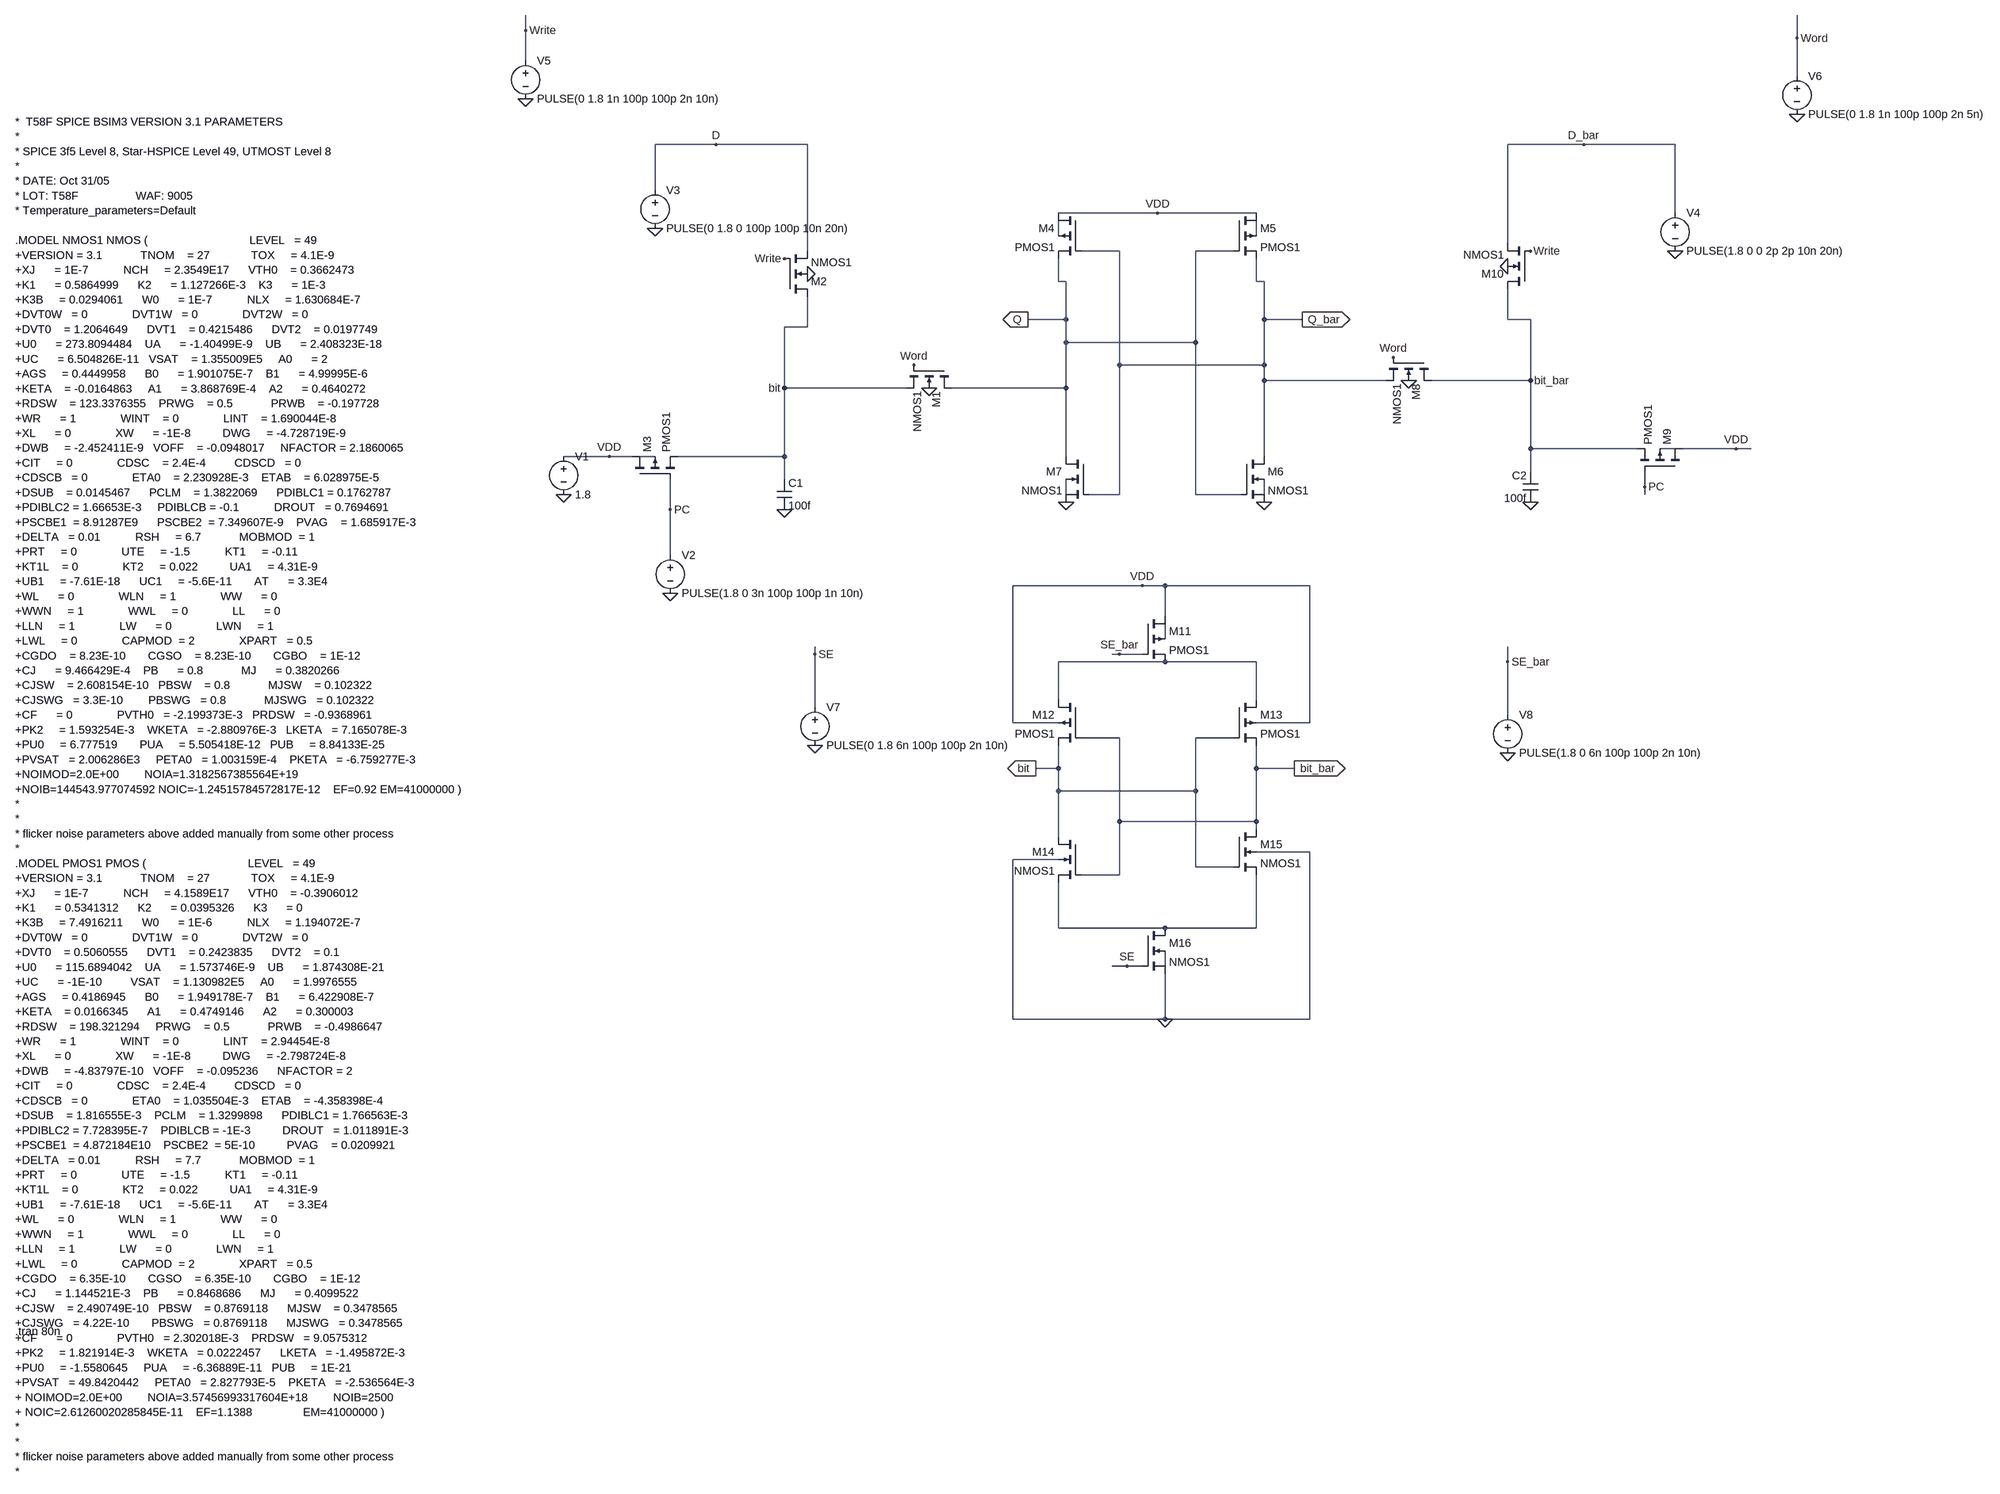
[diagram p0: schematic SRAM_final.asc]
SRAM_final.asc, the LTspice schematic file:
Version 4
SHEET 1 4148 2576
WIRE 1056 -176 1056 -208
WIRE 3728 -160 3728 -208
WIRE 1056 -112 1056 -176
WIRE 3728 -80 3728 -160
WIRE 1456 64 1328 64
WIRE 1648 64 1456 64
WIRE 3280 64 3120 64
WIRE 3472 64 3280 64
WIRE 1328 160 1328 64
WIRE 2384 208 2176 208
WIRE 2592 208 2384 208
WIRE 3472 208 3472 64
WIRE 2176 256 2176 224
WIRE 2592 256 2592 224
WIRE 3120 272 3120 64
WIRE 1648 288 1648 64
WIRE 2304 288 2224 288
WIRE 2544 288 2464 288
WIRE 2176 352 2176 304
WIRE 2192 352 2176 352
WIRE 2592 352 2592 304
WIRE 2608 352 2592 352
WIRE 2192 432 2192 352
WIRE 2192 432 2112 432
WIRE 2608 432 2608 352
WIRE 2688 432 2608 432
WIRE 3120 432 3120 368
WIRE 3168 432 3120 432
WIRE 1648 448 1648 384
WIRE 1648 448 1600 448
WIRE 2192 480 2192 432
WIRE 2464 480 2464 288
WIRE 2464 480 2192 480
WIRE 2304 528 2304 288
WIRE 2608 528 2608 432
WIRE 2608 528 2304 528
WIRE 2608 560 2608 528
WIRE 2864 560 2608 560
WIRE 3168 560 3168 432
WIRE 3168 560 2960 560
WIRE 1600 576 1600 448
WIRE 1856 576 1600 576
WIRE 2192 576 2192 480
WIRE 2192 576 1952 576
WIRE 3168 704 3168 560
WIRE 3392 704 3168 704
WIRE 3472 704 3440 704
WIRE 3600 704 3488 704
WIRE 3632 704 3600 704
WIRE 1232 720 1136 720
WIRE 1280 720 1232 720
WIRE 1328 720 1296 720
WIRE 1600 720 1600 576
WIRE 1600 720 1376 720
WIRE 2192 720 2192 576
WIRE 2608 720 2608 560
WIRE 3168 752 3168 704
WIRE 1600 768 1600 720
WIRE 3408 784 3408 752
WIRE 2192 800 2192 768
WIRE 2304 800 2304 528
WIRE 2304 800 2240 800
WIRE 2464 800 2464 480
WIRE 2560 800 2464 800
WIRE 2608 800 2608 768
WIRE 3408 800 3408 784
WIRE 1360 832 1360 768
WIRE 1360 928 1360 832
WIRE 2352 992 2080 992
WIRE 2400 992 2352 992
WIRE 2704 992 2400 992
WIRE 2400 1056 2400 992
WIRE 2400 1104 2400 1072
WIRE 1664 1136 1664 1120
WIRE 2304 1136 2288 1136
WIRE 2352 1136 2304 1136
WIRE 2400 1152 2176 1152
WIRE 2592 1152 2400 1152
WIRE 3120 1152 3120 1120
WIRE 2176 1232 2176 1152
WIRE 2592 1232 2592 1152
WIRE 1664 1248 1664 1136
WIRE 3120 1264 3120 1152
WIRE 2080 1280 2080 992
WIRE 2176 1280 2080 1280
WIRE 2704 1280 2704 992
WIRE 2704 1280 2592 1280
WIRE 2304 1312 2224 1312
WIRE 2544 1312 2464 1312
WIRE 2176 1376 2176 1328
WIRE 2176 1376 2128 1376
WIRE 2592 1376 2592 1328
WIRE 2672 1376 2592 1376
WIRE 2176 1424 2176 1376
WIRE 2464 1424 2464 1312
WIRE 2464 1424 2176 1424
WIRE 2304 1488 2304 1312
WIRE 2592 1488 2592 1376
WIRE 2592 1488 2304 1488
WIRE 2592 1504 2592 1488
WIRE 2176 1520 2176 1424
WIRE 2704 1552 2592 1552
WIRE 2176 1568 2080 1568
WIRE 2464 1584 2464 1424
WIRE 2544 1584 2464 1584
WIRE 2304 1600 2304 1488
WIRE 2304 1600 2224 1600
WIRE 2176 1712 2176 1616
WIRE 2400 1712 2176 1712
WIRE 2592 1712 2592 1600
WIRE 2592 1712 2400 1712
WIRE 2320 1792 2288 1792
WIRE 2352 1792 2320 1792
WIRE 2400 1792 2400 1760
WIRE 2080 1904 2080 1568
WIRE 2400 1904 2400 1808
WIRE 2400 1904 2080 1904
WIRE 2704 1904 2704 1552
WIRE 2704 1904 2400 1904
FLAG 1872 528 Word
FLAG 1600 576 bit
FLAG 1904 576 0
FLAG 2384 208 VDD
FLAG 2112 432 Q
IOPIN 2112 432 Out
FLAG 2688 432 Q_bar
IOPIN 2688 432 Out
FLAG 2880 512 Word
FLAG 2912 560 0
FLAG 3168 560 bit_bar
FLAG 1600 304 Write
FLAG 3168 288 Write
FLAG 1136 800 0
FLAG 1648 336 0
FLAG 3120 320 0
FLAG 1360 1008 0
FLAG 1232 720 VDD
FLAG 1360 832 PC
FLAG 1328 240 0
FLAG 1600 832 0
FLAG 2192 816 0
FLAG 2608 816 0
FLAG 3168 816 0
FLAG 1456 64 D
FLAG 3600 704 VDD
FLAG 3408 784 PC
FLAG 3472 288 0
FLAG 1056 -32 0
FLAG 3728 0 0
FLAG 1056 -176 Write
FLAG 3728 -160 Word
FLAG 3280 64 D_bar
FLAG 2304 1136 SE_bar
FLAG 2320 1792 SE
FLAG 2352 992 VDD
FLAG 2400 1904 0
FLAG 2128 1376 bit
IOPIN 2128 1376 Out
FLAG 2672 1376 bit_bar
IOPIN 2672 1376 Out
FLAG 1664 1328 0
FLAG 3120 1344 0
FLAG 1664 1136 SE
FLAG 3120 1152 SE_bar
SYMBOL nmos4 1952 528 R90
SYMATTR InstName M1
SYMATTR Value NMOS1
SYMATTR Value2 l=180n w=600n
SYMBOL cap 1584 768 R0
SYMATTR InstName C1
SYMATTR Value 100f
SYMBOL pmos4 1280 768 R270
SYMATTR InstName M3
SYMATTR Value PMOS1
SYMATTR Value2 l=180n w=400n
SYMBOL pmos4 2224 208 M0
SYMATTR InstName M4
SYMATTR Value PMOS1
SYMATTR Value2 l=180n w=400n
SYMBOL pmos4 2544 208 R0
SYMATTR InstName M5
SYMATTR Value PMOS1
SYMATTR Value2 l=180n w=400n
SYMBOL nmos4 2560 720 R0
SYMATTR InstName M6
SYMATTR Value NMOS1
SYMATTR Value2 l=180n w=800n
SYMBOL nmos4 2240 720 M0
SYMATTR InstName M7
SYMATTR Value NMOS1
SYMATTR Value2 l=180n w=800n
SYMBOL nmos4 1600 384 M180
SYMATTR InstName M2
SYMATTR Value NMOS1
SYMATTR Value2 l=180n w=400n
SYMBOL nmos4 2960 512 R90
SYMATTR InstName M8
SYMATTR Value NMOS1
SYMATTR Value2 l=180n w=600n
SYMBOL cap 3184 752 M0
SYMATTR InstName C2
SYMATTR Value 100f
SYMBOL pmos4 3488 752 M270
SYMATTR InstName M9
SYMATTR Value PMOS1
SYMATTR Value2 l=180n w=400n
SYMBOL nmos4 3168 368 R180
SYMATTR InstName M10
SYMATTR Value NMOS1
SYMATTR Value2 l=180n w=400n
SYMBOL voltage 1136 704 R0
SYMATTR InstName V1
SYMATTR Value 1.8
SYMBOL voltage 1360 912 R0
SYMATTR InstName V2
SYMATTR Value PULSE(1.8 0 3n 100p 100p 1n 10n)
SYMBOL voltage 1328 144 R0
SYMATTR InstName V3
SYMATTR Value PULSE(0 1.8 0 100p 100p 10n 20n)
SYMBOL voltage 3472 192 R0
SYMATTR InstName V4
SYMATTR Value PULSE(1.8 0 0 2p 2p 10n 20n)
SYMBOL voltage 1056 -128 R0
SYMATTR InstName V5
SYMATTR Value PULSE(0 1.8 1n 100p 100p 2n 10n)
SYMBOL voltage 3728 -96 R0
SYMATTR InstName V6
SYMATTR Value PULSE(0 1.8 1n 100p 100p 2n 5n)
SYMBOL pmos4 2352 1056 R0
SYMATTR InstName M11
SYMATTR Value PMOS1
SYMATTR Value2 l=180n w=600n
SYMBOL pmos4 2224 1232 M0
SYMATTR InstName M12
SYMATTR Value PMOS1
SYMATTR Value2 l=180n w=400n
SYMBOL pmos4 2544 1232 R0
SYMATTR InstName M13
SYMATTR Value PMOS1
SYMATTR Value2 l=180n w=400n
SYMBOL nmos4 2224 1520 M0
SYMATTR InstName M14
SYMATTR Value NMOS1
SYMATTR Value2 l=180n w=800n
SYMBOL nmos4 2544 1504 R0
SYMATTR InstName M15
SYMATTR Value NMOS1
SYMATTR Value2 l=180n w=800n
SYMBOL nmos4 2352 1712 R0
SYMATTR InstName M16
SYMATTR Value NMOS1
SYMATTR Value2 l=180n w=600n
SYMBOL voltage 1664 1232 R0
SYMATTR InstName V7
SYMATTR Value PULSE(0 1.8 6n 100p 100p 2n 10n)
SYMBOL voltage 3120 1248 R0
SYMATTR InstName V8
SYMATTR Value PULSE(1.8 0 6n 100p 100p 2n 10n)
TEXT -240 16 Left 2 !*  T58F SPICE BSIM3 VERSION 3.1 PARAMETERS\n* \n* SPICE 3f5 Level 8, Star-HSPICE Level 49, UTMOST Level 8\n* \n* DATE: Oct 31/05\n* LOT: T58F                  WAF: 9005\n* Temperature_parameters=Default\n\n.MODEL NMOS1 NMOS (                                LEVEL   = 49\n+VERSION = 3.1            TNOM    = 27             TOX     = 4.1E-9\n+XJ      = 1E-7           NCH     = 2.3549E17      VTH0    = 0.3662473\n+K1      = 0.5864999      K2      = 1.127266E-3    K3      = 1E-3\n+K3B     = 0.0294061      W0      = 1E-7           NLX     = 1.630684E-7\n+DVT0W   = 0              DVT1W   = 0              DVT2W   = 0\n+DVT0    = 1.2064649      DVT1    = 0.4215486      DVT2    = 0.0197749\n+U0      = 273.8094484    UA      = -1.40499E-9    UB      = 2.408323E-18\n+UC      = 6.504826E-11   VSAT    = 1.355009E5     A0      = 2\n+AGS     = 0.4449958      B0      = 1.901075E-7    B1      = 4.99995E-6\n+KETA    = -0.0164863     A1      = 3.868769E-4    A2      = 0.4640272\n+RDSW    = 123.3376355    PRWG    = 0.5            PRWB    = -0.197728\n+WR      = 1              WINT    = 0              LINT    = 1.690044E-8\n+XL      = 0              XW      = -1E-8          DWG     = -4.728719E-9\n+DWB     = -2.452411E-9   VOFF    = -0.0948017     NFACTOR = 2.1860065\n+CIT     = 0              CDSC    = 2.4E-4         CDSCD   = 0\n+CDSCB   = 0              ETA0    = 2.230928E-3    ETAB    = 6.028975E-5\n+DSUB    = 0.0145467      PCLM    = 1.3822069      PDIBLC1 = 0.1762787\n+PDIBLC2 = 1.66653E-3     PDIBLCB = -0.1           DROUT   = 0.7694691\n+PSCBE1  = 8.91287E9      PSCBE2  = 7.349607E-9    PVAG    = 1.685917E-3\n+DELTA   = 0.01           RSH     = 6.7            MOBMOD  = 1\n+PRT     = 0              UTE     = -1.5           KT1     = -0.11\n+KT1L    = 0              KT2     = 0.022          UA1     = 4.31E-9\n+UB1     = -7.61E-18      UC1     = -5.6E-11       AT      = 3.3E4\n+WL      = 0              WLN     = 1              WW      = 0\n+WWN     = 1              WWL     = 0              LL      = 0\n+LLN     = 1              LW      = 0              LWN     = 1\n+LWL     = 0              CAPMOD  = 2              XPART   = 0.5\n+CGDO    = 8.23E-10       CGSO    = 8.23E-10       CGBO    = 1E-12\n+CJ      = 9.466429E-4    PB      = 0.8            MJ      = 0.3820266\n+CJSW    = 2.608154E-10   PBSW    = 0.8            MJSW    = 0.102322\n+CJSWG   = 3.3E-10        PBSWG   = 0.8            MJSWG   = 0.102322\n+CF      = 0              PVTH0   = -2.199373E-3   PRDSW   = -0.9368961\n+PK2     = 1.593254E-3    WKETA   = -2.880976E-3   LKETA   = 7.165078E-3\n+PU0     = 6.777519       PUA     = 5.505418E-12   PUB     = 8.84133E-25\n+PVSAT   = 2.006286E3     PETA0   = 1.003159E-4    PKETA   = -6.759277E-3\n+NOIMOD=2.0E+00		NOIA=1.3182567385564E+19\n+NOIB=144543.977074592 NOIC=-1.24515784572817E-12	EF=0.92 EM=41000000 )\n*\n*\n* flicker noise parameters above added manually from some other process\n* \n.MODEL PMOS1 PMOS (                                LEVEL   = 49\n+VERSION = 3.1            TNOM    = 27             TOX     = 4.1E-9\n+XJ      = 1E-7           NCH     = 4.1589E17      VTH0    = -0.3906012\n+K1      = 0.5341312      K2      = 0.0395326      K3      = 0\n+K3B     = 7.4916211      W0      = 1E-6           NLX     = 1.194072E-7\n+DVT0W   = 0              DVT1W   = 0              DVT2W   = 0\n+DVT0    = 0.5060555      DVT1    = 0.2423835      DVT2    = 0.1\n+U0      = 115.6894042    UA      = 1.573746E-9    UB      = 1.874308E-21\n+UC      = -1E-10         VSAT    = 1.130982E5     A0      = 1.9976555\n+AGS     = 0.4186945      B0      = 1.949178E-7    B1      = 6.422908E-7\n+KETA    = 0.0166345      A1      = 0.4749146      A2      = 0.300003\n+RDSW    = 198.321294     PRWG    = 0.5            PRWB    = -0.4986647\n+WR      = 1              WINT    = 0              LINT    = 2.94454E-8\n+XL      = 0              XW      = -1E-8          DWG     = -2.798724E-8\n+DWB     = -4.83797E-10   VOFF    = -0.095236      NFACTOR = 2\n+CIT     = 0              CDSC    = 2.4E-4         CDSCD   = 0\n+CDSCB   = 0              ETA0    = 1.035504E-3    ETAB    = -4.358398E-4\n+DSUB    = 1.816555E-3    PCLM    = 1.3299898      PDIBLC1 = 1.766563E-3\n+PDIBLC2 = 7.728395E-7    PDIBLCB = -1E-3          DROUT   = 1.011891E-3\n+PSCBE1  = 4.872184E10    PSCBE2  = 5E-10          PVAG    = 0.0209921\n+DELTA   = 0.01           RSH     = 7.7            MOBMOD  = 1\n+PRT     = 0              UTE     = -1.5           KT1     = -0.11\n+KT1L    = 0              KT2     = 0.022          UA1     = 4.31E-9\n+UB1     = -7.61E-18      UC1     = -5.6E-11       AT      = 3.3E4\n+WL      = 0              WLN     = 1              WW      = 0\n+WWN     = 1              WWL     = 0              LL      = 0\n+LLN     = 1              LW      = 0              LWN     = 1\n+LWL     = 0              CAPMOD  = 2              XPART   = 0.5\n+CGDO    = 6.35E-10       CGSO    = 6.35E-10       CGBO    = 1E-12\n+CJ      = 1.144521E-3    PB      = 0.8468686      MJ      = 0.4099522\n+CJSW    = 2.490749E-10   PBSW    = 0.8769118      MJSW    = 0.3478565\n+CJSWG   = 4.22E-10       PBSWG   = 0.8769118      MJSWG   = 0.3478565\n+CF      = 0              PVTH0   = 2.302018E-3    PRDSW   = 9.0575312\n+PK2     = 1.821914E-3    WKETA   = 0.0222457      LKETA   = -1.495872E-3\n+PU0     = -1.5580645     PUA     = -6.36889E-11   PUB     = 1E-21\n+PVSAT   = 49.8420442     PETA0   = 2.827793E-5    PKETA   = -2.536564E-3 \n+ NOIMOD=2.0E+00		NOIA=3.57456993317604E+18		NOIB=2500\n+ NOIC=2.61260020285845E-11	EF=1.1388				EM=41000000 )\n*\n*\n* flicker noise parameters above added manually from some other process\n*
TEXT -240 2560 Left 2 !.tran 80n

The netlist it stands for:
* SRAM_final.asc
M1 Q Word bit 0 NMOS1 l=180n w=600n
C1 bit 0 100f
M3 VDD PC bit N004 PMOS1 l=180n w=400n
M4 VDD Q_bar Q N001 PMOS1 l=180n w=400n
M5 VDD Q Q_bar N002 PMOS1 l=180n w=400n
M6 Q_bar Q 0 N006 NMOS1 l=180n w=800n
M7 Q Q_bar 0 N005 NMOS1 l=180n w=800n
M2 bit Write D 0 NMOS1 l=180n w=400n
M8 bit_bar Word Q_bar 0 NMOS1 l=180n w=600n
C2 bit_bar 0 100f
M9 VDD PC bit_bar N003 PMOS1 l=180n w=400n
M10 bit_bar Write D_bar 0 NMOS1 l=180n w=400n
V1 VDD 0 1.8
V2 PC 0 PULSE(1.8 0 3n 100p 100p 1n 10n)
V3 D 0 PULSE(0 1.8 0 100p 100p 10n 20n)
V4 D_bar 0 PULSE(1.8 0 0 2p 2p 10n 20n)
V5 Write 0 PULSE(0 1.8 1n 100p 100p 2n 10n)
V6 Word 0 PULSE(0 1.8 1n 100p 100p 2n 5n)
M11 VDD SE_bar N008 N007 PMOS1 l=180n w=600n
M12 N008 bit_bar bit VDD PMOS1 l=180n w=400n
M13 N008 bit bit_bar VDD PMOS1 l=180n w=400n
M14 bit bit_bar N009 0 NMOS1 l=180n w=800n
M15 bit_bar bit N009 0 NMOS1 l=180n w=800n
M16 N009 SE 0 N010 NMOS1 l=180n w=600n
V7 SE 0 PULSE(0 1.8 6n 100p 100p 2n 10n)
V8 SE_bar 0 PULSE(1.8 0 6n 100p 100p 2n 10n)
.model NMOS NMOS
.model PMOS PMOS
.lib standard.mos
*  T58F SPICE BSIM3 VERSION 3.1 PARAMETERS
*
* SPICE 3f5 Level 8, Star-HSPICE Level 49, UTMOST Level 8
*
* DATE: Oct 31/05
* LOT: T58F                  WAF: 9005
* Temperature_parameters=Default
.MODEL NMOS1 NMOS (                                LEVEL   = 49
+VERSION = 3.1            TNOM    = 27             TOX     = 4.1E-9
+XJ      = 1E-7           NCH     = 2.3549E17      VTH0    = 0.3662473
+K1      = 0.5864999      K2      = 1.127266E-3    K3      = 1E-3
+K3B     = 0.0294061      W0      = 1E-7           NLX     = 1.630684E-7
+DVT0W   = 0              DVT1W   = 0              DVT2W   = 0
+DVT0    = 1.2064649      DVT1    = 0.4215486      DVT2    = 0.0197749
+U0      = 273.8094484    UA      = -1.40499E-9    UB      = 2.408323E-18
+UC      = 6.504826E-11   VSAT    = 1.355009E5     A0      = 2
+AGS     = 0.4449958      B0      = 1.901075E-7    B1      = 4.99995E-6
+KETA    = -0.0164863     A1      = 3.868769E-4    A2      = 0.4640272
+RDSW    = 123.3376355    PRWG    = 0.5            PRWB    = -0.197728
+WR      = 1              WINT    = 0              LINT    = 1.690044E-8
+XL      = 0              XW      = -1E-8          DWG     = -4.728719E-9
+DWB     = -2.452411E-9   VOFF    = -0.0948017     NFACTOR = 2.1860065
+CIT     = 0              CDSC    = 2.4E-4         CDSCD   = 0
+CDSCB   = 0              ETA0    = 2.230928E-3    ETAB    = 6.028975E-5
+DSUB    = 0.0145467      PCLM    = 1.3822069      PDIBLC1 = 0.1762787
+PDIBLC2 = 1.66653E-3     PDIBLCB = -0.1           DROUT   = 0.7694691
+PSCBE1  = 8.91287E9      PSCBE2  = 7.349607E-9    PVAG    = 1.685917E-3
+DELTA   = 0.01           RSH     = 6.7            MOBMOD  = 1
+PRT     = 0              UTE     = -1.5           KT1     = -0.11
+KT1L    = 0              KT2     = 0.022          UA1     = 4.31E-9
+UB1     = -7.61E-18      UC1     = -5.6E-11       AT      = 3.3E4
+WL      = 0              WLN     = 1              WW      = 0
+WWN     = 1              WWL     = 0              LL      = 0
+LLN     = 1              LW      = 0              LWN     = 1
+LWL     = 0              CAPMOD  = 2              XPART   = 0.5
+CGDO    = 8.23E-10       CGSO    = 8.23E-10       CGBO    = 1E-12
+CJ      = 9.466429E-4    PB      = 0.8            MJ      = 0.3820266
+CJSW    = 2.608154E-10   PBSW    = 0.8            MJSW    = 0.102322
+CJSWG   = 3.3E-10        PBSWG   = 0.8            MJSWG   = 0.102322
+CF      = 0              PVTH0   = -2.199373E-3   PRDSW   = -0.9368961
+PK2     = 1.593254E-3    WKETA   = -2.880976E-3   LKETA   = 7.165078E-3
+PU0     = 6.777519       PUA     = 5.505418E-12   PUB     = 8.84133E-25
+PVSAT   = 2.006286E3     PETA0   = 1.003159E-4    PKETA   = -6.759277E-3
+NOIMOD=2.0E+00		NOIA=1.3182567385564E+19
+NOIB=144543.977074592 NOIC=-1.24515784572817E-12	EF=0.92 EM=41000000 )
*
*
* flicker noise parameters above added manually from some other process
*
.MODEL PMOS1 PMOS (                                LEVEL   = 49
+VERSION = 3.1            TNOM    = 27             TOX     = 4.1E-9
+XJ      = 1E-7           NCH     = 4.1589E17      VTH0    = -0.3906012
+K1      = 0.5341312      K2      = 0.0395326      K3      = 0
+K3B     = 7.4916211      W0      = 1E-6           NLX     = 1.194072E-7
+DVT0W   = 0              DVT1W   = 0              DVT2W   = 0
+DVT0    = 0.5060555      DVT1    = 0.2423835      DVT2    = 0.1
+U0      = 115.6894042    UA      = 1.573746E-9    UB      = 1.874308E-21
+UC      = -1E-10         VSAT    = 1.130982E5     A0      = 1.9976555
+AGS     = 0.4186945      B0      = 1.949178E-7    B1      = 6.422908E-7
+KETA    = 0.0166345      A1      = 0.4749146      A2      = 0.300003
+RDSW    = 198.321294     PRWG    = 0.5            PRWB    = -0.4986647
+WR      = 1              WINT    = 0              LINT    = 2.94454E-8
+XL      = 0              XW      = -1E-8          DWG     = -2.798724E-8
+DWB     = -4.83797E-10   VOFF    = -0.095236      NFACTOR = 2
+CIT     = 0              CDSC    = 2.4E-4         CDSCD   = 0
+CDSCB   = 0              ETA0    = 1.035504E-3    ETAB    = -4.358398E-4
+DSUB    = 1.816555E-3    PCLM    = 1.3299898      PDIBLC1 = 1.766563E-3
+PDIBLC2 = 7.728395E-7    PDIBLCB = -1E-3          DROUT   = 1.011891E-3
+PSCBE1  = 4.872184E10    PSCBE2  = 5E-10          PVAG    = 0.0209921
+DELTA   = 0.01           RSH     = 7.7            MOBMOD  = 1
+PRT     = 0              UTE     = -1.5           KT1     = -0.11
+KT1L    = 0              KT2     = 0.022          UA1     = 4.31E-9
+UB1     = -7.61E-18      UC1     = -5.6E-11       AT      = 3.3E4
+WL      = 0              WLN     = 1              WW      = 0
+WWN     = 1              WWL     = 0              LL      = 0
+LLN     = 1              LW      = 0              LWN     = 1
+LWL     = 0              CAPMOD  = 2              XPART   = 0.5
+CGDO    = 6.35E-10       CGSO    = 6.35E-10       CGBO    = 1E-12
+CJ      = 1.144521E-3    PB      = 0.8468686      MJ      = 0.4099522
+CJSW    = 2.490749E-10   PBSW    = 0.8769118      MJSW    = 0.3478565
+CJSWG   = 4.22E-10       PBSWG   = 0.8769118      MJSWG   = 0.3478565
+CF      = 0              PVTH0   = 2.302018E-3    PRDSW   = 9.0575312
+PK2     = 1.821914E-3    WKETA   = 0.0222457      LKETA   = -1.495872E-3
+PU0     = -1.5580645     PUA     = -6.36889E-11   PUB     = 1E-21
+PVSAT   = 49.8420442     PETA0   = 2.827793E-5    PKETA   = -2.536564E-3
+ NOIMOD=2.0E+00		NOIA=3.57456993317604E+18		NOIB=2500
+ NOIC=2.61260020285845E-11	EF=1.1388				EM=41000000 )
*
*
* flicker noise parameters above added manually from some other process
*
.tran 80n
.backanno
.end